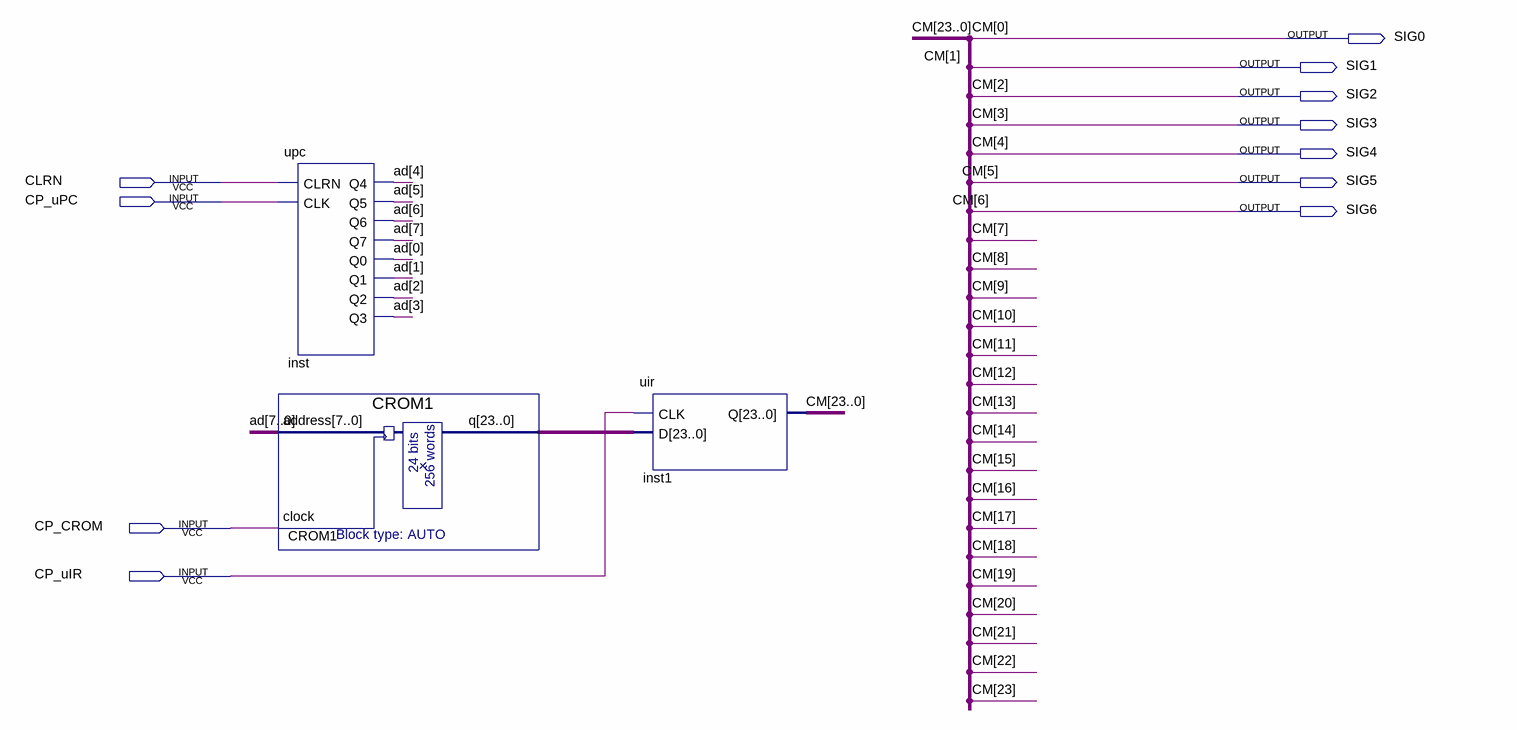
[diagram p0: schematic sheet]
// Quartus schematic cu.bdf as structural Verilog: 3 symbols, 11 pins
module cu (
  input  CLRN,
  input  CP_uPC,
  input  CP_CROM,
  input  CP_uIR,
  output SIG0,
  output SIG1,
  output SIG2,
  output SIG3,
  output SIG4,
  output SIG5,
  output SIG6
);

  wire [7:0] ad;
  wire [23:0] CROM1_q;
  wire [23:7] CM;

  upc inst (
    .CLRN(CLRN), .CLK(CP_uPC), .Q4(ad[4]), .Q5(ad[5]), .Q6(ad[6]), .Q7(ad[7]), .Q0(ad[0]), .Q1(ad[1]),
    .Q2(ad[2]), .Q3(ad[3]));
  CROM1 CROM1 (.address(ad), .clock(CP_CROM), .q(CROM1_q));
  uir inst1 (.CLK(CP_uIR), .D(CROM1_q), .Q({CM, SIG6, SIG5, SIG4, SIG3, SIG2, SIG1, SIG0}));

  // Other names for the same wires on the sheet: CM[6:0] = {SIG6, SIG5, SIG4, SIG3, SIG2, SIG1, SIG0}
endmodule
